# Altium schematic sheet Temp_Interface.SchDoc: NTC Thermistor Interface
size A4; DrawnBy: Samyar Sadat Akhavi; Revision: 1.0; SheetNumber: 9; SheetTotal: 13
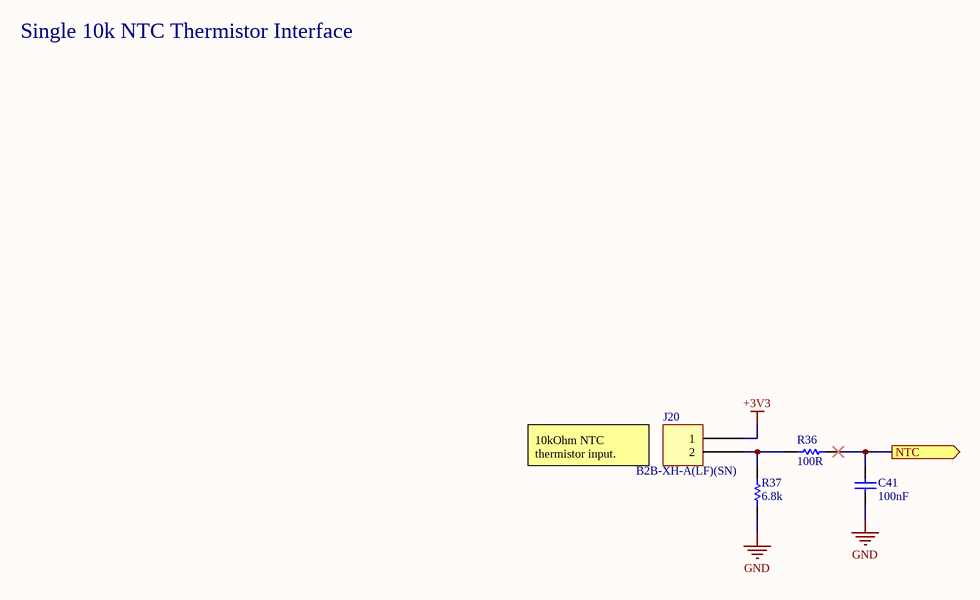
[diagram p0: Temp_Interface.SchDoc]

## Parts
?  (no value)  (graphical)
C41  100nF  [CAP_SMD_603]
J20  B2B-XH-A(LF)(SN)  [JST XH B2B-XH-A]
R36  100R  [RES_0603]
R37  6.8k  [RES_0603]

## Ports
NTC (out, see Thermal[1B])

## Nets
+3V3: J20.1
GND: C41.1 R37.1
NTC: C41.2 R36.1 ; port NTC
NetJ20_2: J20.2 R36.2 R37.2

## Notes on the sheet
- Single 10k NTC Thermistor Interface
- 10kOhm NTC thermistor input.
- Sub-Project:
- Size:
- Drawn By:
- Revision:
- Date:
- File:
- Sheet:
- of

## Library data of the parts
? = Standard Title Block
C41 = Non-polar Capacitor: Generic Ceramic Capacitor; Voltage: 6.3V; Value: 100nF
J20 = B2B-XH-A(LF)(SN): CONN HEADER VERT 2POS 2.5MM; Manufacturer: JST Sales America Inc.; Contact Length - Post: 0.134" (3.40mm); Current Rating (Amps): 3A; Material Flammability Rating: UL94 V-0; Number of Positions: 2; Number of Positions Loaded: All; Pitch - Mating: 0.098" (2.50mm); Shrouding: Shrouded - 4 Wall; Style: Board to Cable/Wire; Voltage Rating: 250V; Part Number: B2B-XH-A(LF)(SN); ComponentLink1Description: Datasheet; ComponentLink1URL: http://www.jst-mfg.com/product/pdf/eng/eXH.pdf; ComponentLink2Description: DigiKey Link; ComponentLink2URL: http://digikey.com/product-detail/en/jst-sales-america-inc/B2B-XH-A-LF-SN/455-2247-ND/1651045; Connector Type: Header; Contact Finish - Mating: Tin; Contact Finish - Post: Tin; Contact Material: Brass; Contact Shape: Square; Contact Type: Male Pin; Fastening Type: Detent Lock; Insulation Color: Natural; Insulation Height: 0.276" (7.00mm); Insulation Material: Polyamide (PA66), Nylon 6/6; LastUpdated: 1/12/2020 11:46:08 PM; Lifecycle Status: Active; Minimum Order: 1; Mounting Type: Through Hole; Number of Rows: 1; Operating Temperature: -25°C ~ 85°C; Packaging: Bulk; PartId: 67; Part Status: Active; Price: 0.15; Series: XH; Supplier 1: DigiKey; Supplier Part Number 1: 455-2247-ND; Termination: Press-Fit, Solder
R36 R37 = Resistor: Power: 1/8W
  R36: Value: 100R
  R37: Value: 6.8k